# Altium schematic sheet CPU_MIPI_DSI_CSI.SchDoc
size 420 x 297 mm; Scale: 1:1; DocumentType: Схема электрическая принципиальная; SheetNumber: 20; SheetTotal: 32; DocumentTypeShort: Э3; DocumentInvertoryNumber: ㅤ
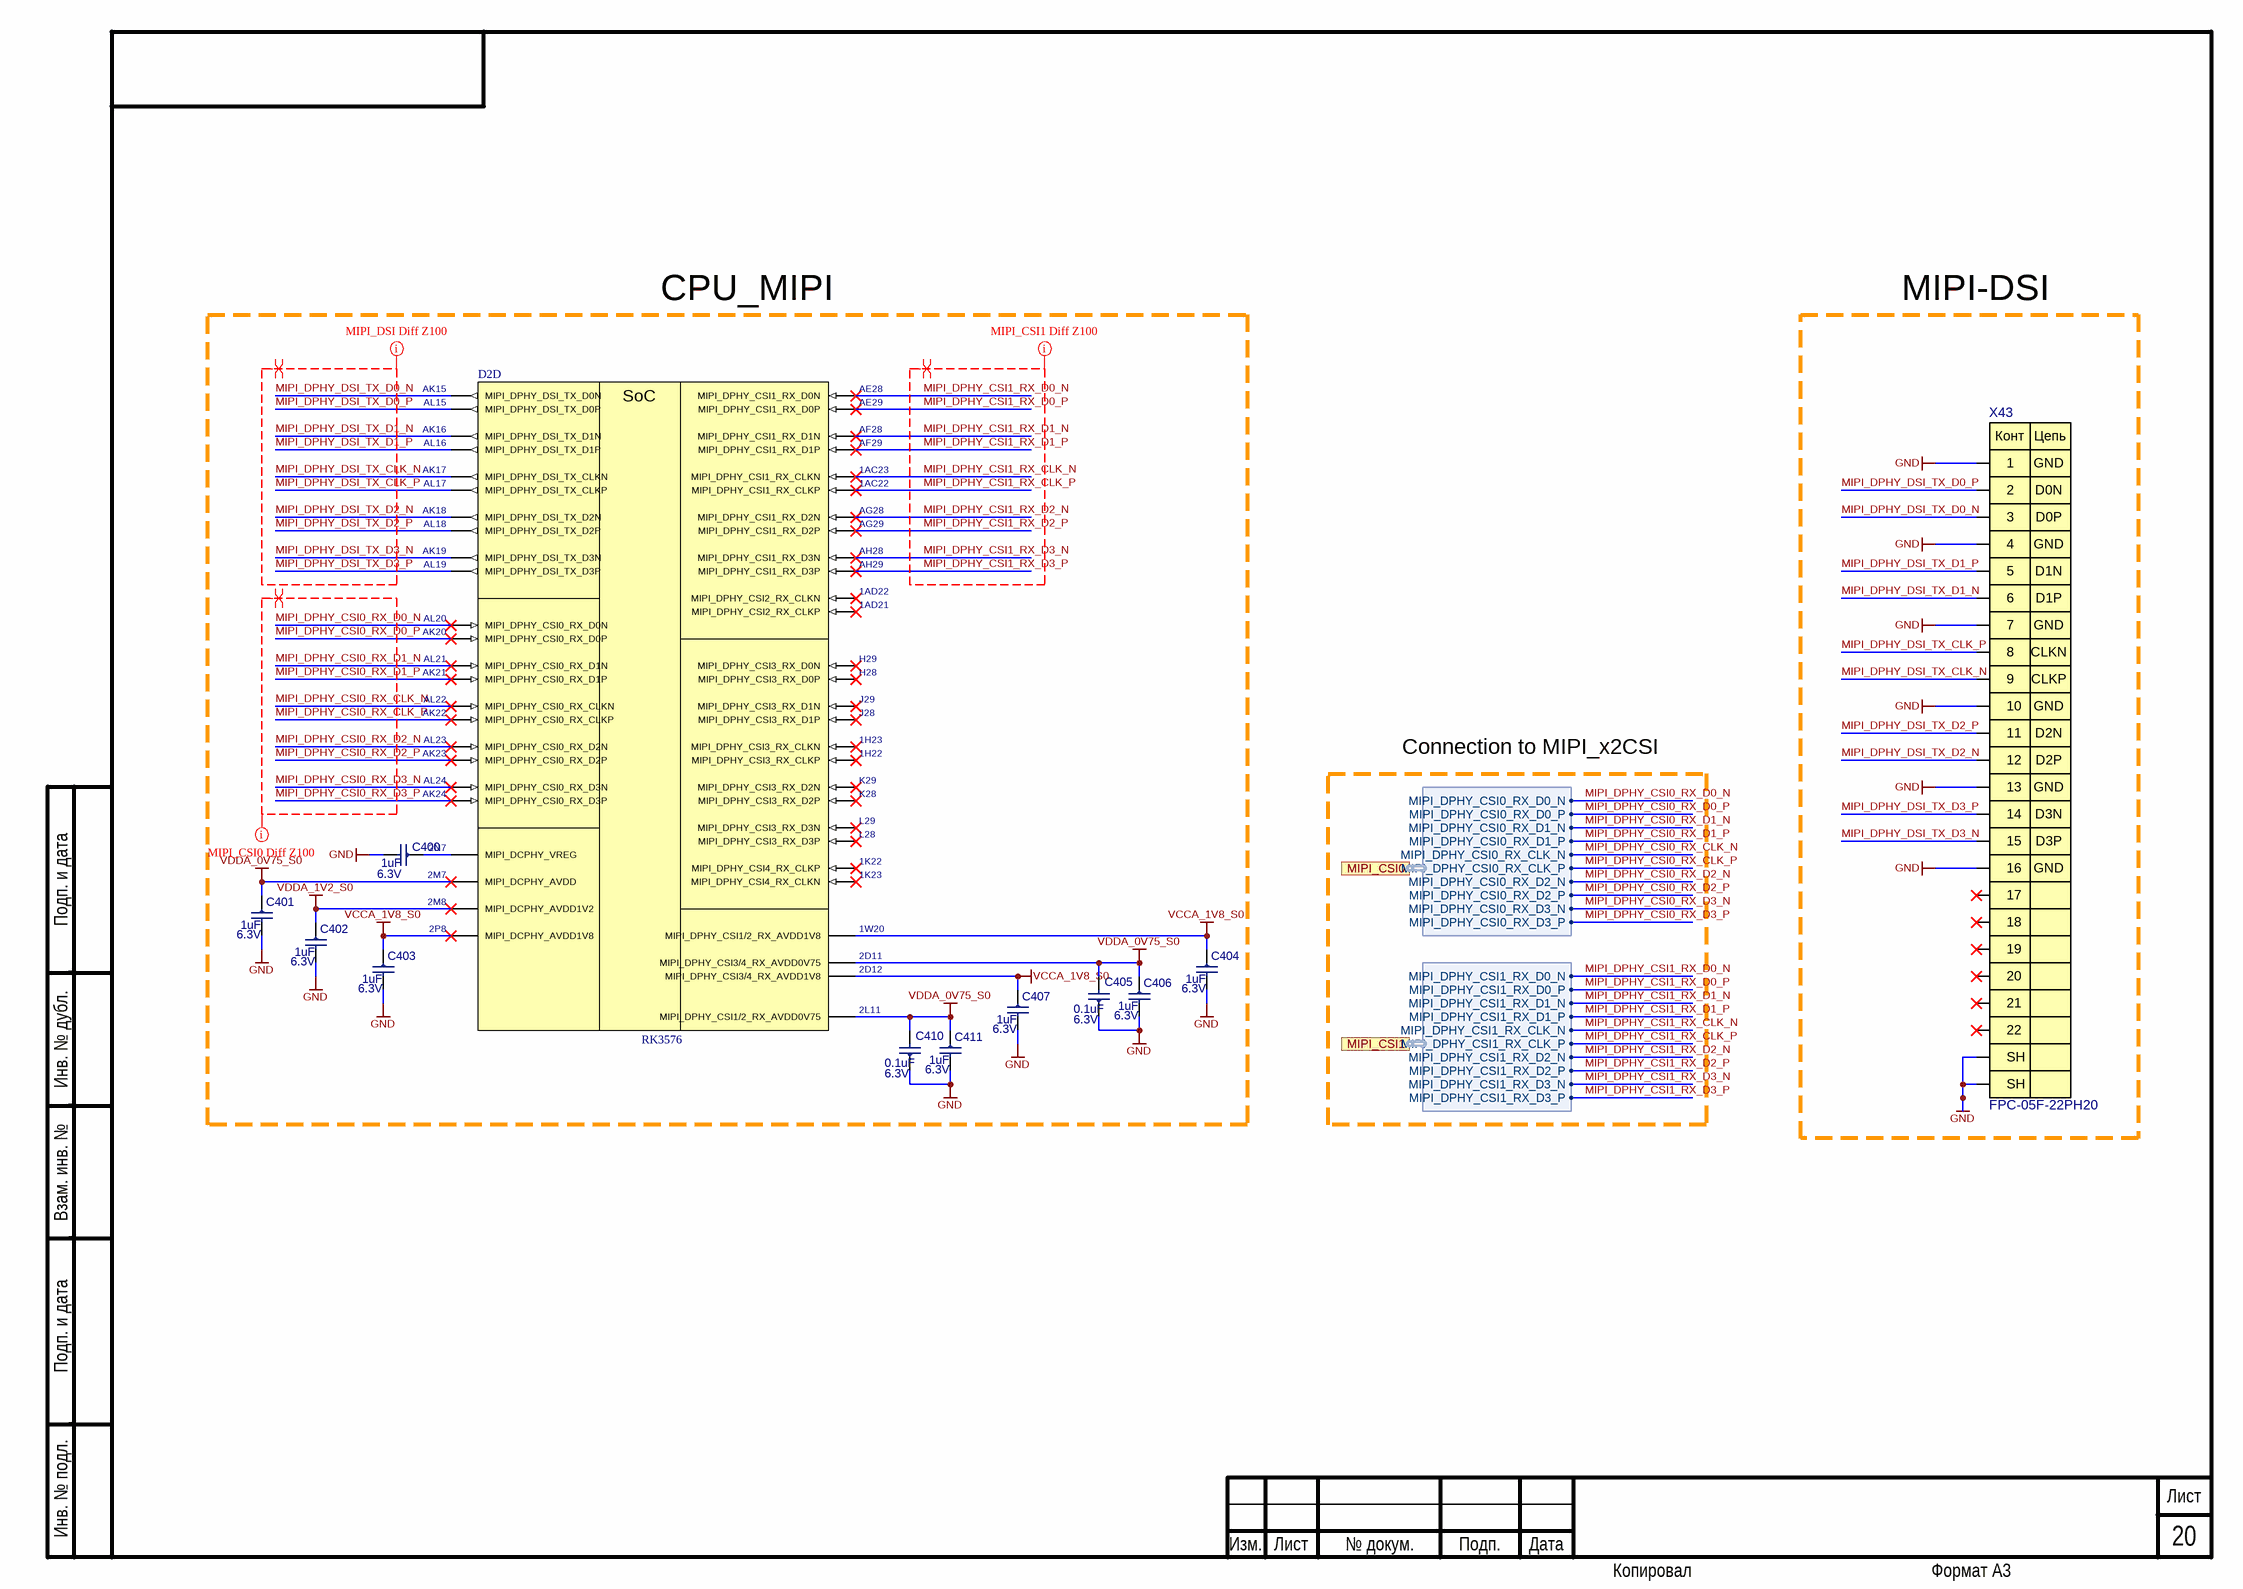
[diagram p0: CPU_MIPI_DSI_CSI.SchDoc]

## Parts
C400  1uF  Voltage: 6.3V  [C0201]
C401  1uF  Voltage: 6.3V  [C0201]
C402  1uF  Voltage: 6.3V  [C0201]
C403  1uF  Voltage: 6.3V  [C0201]
C404  1uF  Voltage: 6.3V  [C0201]
C405  0.1uF  Voltage: 6.3V  [C0201]
C406  1uF  Voltage: 6.3V  [C0201]
C407  1uF  Voltage: 6.3V  [C0201]
C410  0.1uF  Voltage: 6.3V  [C0201]
C411  1uF  Voltage: 6.3V  [C0201]
D2  RK3576  [BGAFCCSP698L]  (part D of 7)
X43  FPC-05F-22PH20  [FPC-05F-22PH20]

## Ports
MIPI_CSI0 (harness MIPI_CSI0), MIPI_CSI1 (harness MIPI_CSI1)

## Harnesses
MIPI_CSI1: MIPI_DPHY_CSI1_RX_D3_P, MIPI_DPHY_CSI1_RX_D3_N, MIPI_DPHY_CSI1_RX_D2_P, MIPI_DPHY_CSI1_RX_D2_N, MIPI_DPHY_CSI1_RX_CLK_P, MIPI_DPHY_CSI1_RX_CLK_N, MIPI_DPHY_CSI1_RX_D1_P, MIPI_DPHY_CSI1_RX_D1_N, MIPI_DPHY_CSI1_RX_D0_P, MIPI_DPHY_CSI1_RX_D0_N
MIPI_CSI0: MIPI_DPHY_CSI0_RX_D3_P, MIPI_DPHY_CSI0_RX_D3_N, MIPI_DPHY_CSI0_RX_D2_P, MIPI_DPHY_CSI0_RX_D2_N, MIPI_DPHY_CSI0_RX_CLK_P, MIPI_DPHY_CSI0_RX_CLK_N, MIPI_DPHY_CSI0_RX_D1_P, MIPI_DPHY_CSI0_RX_D1_N, MIPI_DPHY_CSI0_RX_D0_P, MIPI_DPHY_CSI0_RX_D0_N

## Nets
GND: C400.2 C401.2 C402.2 C403.2 C404.2 C405.1 C406.2 C407.2 C410.1 C411.2 X43.1 X43.4 X43.7 X43.10 X43.13 X43.16 X43.23(SH) X43.24(SH)
VCCA_1V8_S0: C403.1 C404.1 C407.1 D2.1W20(MIPI_DPHY_CSI1/2_RX_AVDD1V8) D2.2D12(MIPI_DPHY_CSI3/4_RX_AVDD1V8) D2.2P8(MIPI_DCPHY_AVDD1V8)
VDDA_0V75_S0: C401.1 C405.2 C406.1 C410.2 C411.1 D2.2D11(MIPI_DPHY_CSI3/4_RX_AVDD0V75) D2.2L11(MIPI_DPHY_CSI1/2_RX_AVDD0V75) D2.2M7(MIPI_DCPHY_AVDD)
VDDA_1V2_S0: C402.1 D2.2M8(MIPI_DCPHY_AVDD1V2)
MIPI_DPHY_CSI0_RX_CLK_N: D2.AL22(MIPI_DPHY_CSI0_RX_CLKN) ; port MIPI_CSI0.MIPI_DPHY_CSI0_RX_CLK_N
MIPI_DPHY_CSI0_RX_CLK_P: D2.AK22(MIPI_DPHY_CSI0_RX_CLKP) ; port MIPI_CSI0.MIPI_DPHY_CSI0_RX_CLK_P
MIPI_DPHY_CSI0_RX_D0_N: D2.AL20(MIPI_DPHY_CSI0_RX_D0N) ; port MIPI_CSI0.MIPI_DPHY_CSI0_RX_D0_N
MIPI_DPHY_CSI0_RX_D0_P: D2.AK20(MIPI_DPHY_CSI0_RX_D0P) ; port MIPI_CSI0.MIPI_DPHY_CSI0_RX_D0_P
MIPI_DPHY_CSI0_RX_D1_N: D2.AL21(MIPI_DPHY_CSI0_RX_D1N) ; port MIPI_CSI0.MIPI_DPHY_CSI0_RX_D1_N
MIPI_DPHY_CSI0_RX_D1_P: D2.AK21(MIPI_DPHY_CSI0_RX_D1P) ; port MIPI_CSI0.MIPI_DPHY_CSI0_RX_D1_P
MIPI_DPHY_CSI0_RX_D2_N: D2.AL23(MIPI_DPHY_CSI0_RX_D2N) ; port MIPI_CSI0.MIPI_DPHY_CSI0_RX_D2_N
MIPI_DPHY_CSI0_RX_D2_P: D2.AK23(MIPI_DPHY_CSI0_RX_D2P) ; port MIPI_CSI0.MIPI_DPHY_CSI0_RX_D2_P
MIPI_DPHY_CSI0_RX_D3_N: D2.AL24(MIPI_DPHY_CSI0_RX_D3N) ; port MIPI_CSI0.MIPI_DPHY_CSI0_RX_D3_N
MIPI_DPHY_CSI0_RX_D3_P: D2.AK24(MIPI_DPHY_CSI0_RX_D3P) ; port MIPI_CSI0.MIPI_DPHY_CSI0_RX_D3_P
MIPI_DPHY_CSI1_RX_CLK_N: D2.1AC23(MIPI_DPHY_CSI1_RX_CLKN) ; port MIPI_CSI1.MIPI_DPHY_CSI1_RX_CLK_N
MIPI_DPHY_CSI1_RX_CLK_P: D2.1AC22(MIPI_DPHY_CSI1_RX_CLKP) ; port MIPI_CSI1.MIPI_DPHY_CSI1_RX_CLK_P
MIPI_DPHY_CSI1_RX_D0_N: D2.AE28(MIPI_DPHY_CSI1_RX_D0N) ; port MIPI_CSI1.MIPI_DPHY_CSI1_RX_D0_N
MIPI_DPHY_CSI1_RX_D0_P: D2.AE29(MIPI_DPHY_CSI1_RX_D0P) ; port MIPI_CSI1.MIPI_DPHY_CSI1_RX_D0_P
MIPI_DPHY_CSI1_RX_D1_N: D2.AF28(MIPI_DPHY_CSI1_RX_D1N) ; port MIPI_CSI1.MIPI_DPHY_CSI1_RX_D1_N
MIPI_DPHY_CSI1_RX_D1_P: D2.AF29(MIPI_DPHY_CSI1_RX_D1P) ; port MIPI_CSI1.MIPI_DPHY_CSI1_RX_D1_P
MIPI_DPHY_CSI1_RX_D2_N: D2.AG28(MIPI_DPHY_CSI1_RX_D2N) ; port MIPI_CSI1.MIPI_DPHY_CSI1_RX_D2_N
MIPI_DPHY_CSI1_RX_D2_P: D2.AG29(MIPI_DPHY_CSI1_RX_D2P) ; port MIPI_CSI1.MIPI_DPHY_CSI1_RX_D2_P
MIPI_DPHY_CSI1_RX_D3_N: D2.AH28(MIPI_DPHY_CSI1_RX_D3N) ; port MIPI_CSI1.MIPI_DPHY_CSI1_RX_D3_N
MIPI_DPHY_CSI1_RX_D3_P: D2.AH29(MIPI_DPHY_CSI1_RX_D3P) ; port MIPI_CSI1.MIPI_DPHY_CSI1_RX_D3_P
MIPI_DPHY_DSI_TX_CLK_N: D2.AK17(MIPI_DPHY_DSI_TX_CLKN) X43.9
MIPI_DPHY_DSI_TX_CLK_P: D2.AL17(MIPI_DPHY_DSI_TX_CLKP) X43.8
MIPI_DPHY_DSI_TX_D0_N: D2.AK15(MIPI_DPHY_DSI_TX_D0N) X43.3
MIPI_DPHY_DSI_TX_D0_P: D2.AL15(MIPI_DPHY_DSI_TX_D0P) X43.2
MIPI_DPHY_DSI_TX_D1_N: D2.AK16(MIPI_DPHY_DSI_TX_D1N) X43.6
MIPI_DPHY_DSI_TX_D1_P: D2.AL16(MIPI_DPHY_DSI_TX_D1P) X43.5
MIPI_DPHY_DSI_TX_D2_N: D2.AK18(MIPI_DPHY_DSI_TX_D2N) X43.12
MIPI_DPHY_DSI_TX_D2_P: D2.AL18(MIPI_DPHY_DSI_TX_D2P) X43.11
MIPI_DPHY_DSI_TX_D3_N: D2.AK19(MIPI_DPHY_DSI_TX_D3N) X43.15
MIPI_DPHY_DSI_TX_D3_P: D2.AL19(MIPI_DPHY_DSI_TX_D3P) X43.14
NetC400_1: C400.1 D2.2N7(MIPI_DCPHY_VREG)

Not connected (* = marked no-connect by the designer): D2 1AD21(MIPI_DPHY_CSI2_RX_CLKP)* 1AD22(MIPI_DPHY_CSI2_RX_CLKN)* 1H22(MIPI_DPHY_CSI3_RX_CLKP)* 1H23(MIPI_DPHY_CSI3_RX_CLKN)* 1K22(MIPI_DPHY_CSI4_RX_CLKP)* 1K23(MIPI_DPHY_CSI4_RX_CLKN)* H28(MIPI_DPHY_CSI3_RX_D0P)* H29(MIPI_DPHY_CSI3_RX_D0N)* J28(MIPI_DPHY_CSI3_RX_D1P)* J29(MIPI_DPHY_CSI3_RX_D1N)* K28(MIPI_DPHY_CSI3_RX_D2P)* K29(MIPI_DPHY_CSI3_RX_D2N)* L28(MIPI_DPHY_CSI3_RX_D3P)* L29(MIPI_DPHY_CSI3_RX_D3N)*; X43 17* 18* 19* 20* 21* 22*

## Layout directives
net class MIPI_CSI1: MIPI_DPHY_CSI1_RX_CLK_N, MIPI_DPHY_CSI1_RX_CLK_P, MIPI_DPHY_CSI1_RX_D0_N, MIPI_DPHY_CSI1_RX_D0_P, MIPI_DPHY_CSI1_RX_D1_N, MIPI_DPHY_CSI1_RX_D1_P, MIPI_DPHY_CSI1_RX_D2_N, MIPI_DPHY_CSI1_RX_D2_P, MIPI_DPHY_CSI1_RX_D3_N, MIPI_DPHY_CSI1_RX_D3_P
net class MIPI_DSI: MIPI_DPHY_DSI_TX_CLK_N, MIPI_DPHY_DSI_TX_CLK_P, MIPI_DPHY_DSI_TX_D0_N, MIPI_DPHY_DSI_TX_D0_P, MIPI_DPHY_DSI_TX_D1_N, MIPI_DPHY_DSI_TX_D1_P, MIPI_DPHY_DSI_TX_D2_N, MIPI_DPHY_DSI_TX_D2_P, MIPI_DPHY_DSI_TX_D3_N, MIPI_DPHY_DSI_TX_D3_P
net class MIPI_CSI0: MIPI_DPHY_CSI0_RX_CLK_N, MIPI_DPHY_CSI0_RX_CLK_P, MIPI_DPHY_CSI0_RX_D0_N, MIPI_DPHY_CSI0_RX_D0_P, MIPI_DPHY_CSI0_RX_D1_N, MIPI_DPHY_CSI0_RX_D1_P, MIPI_DPHY_CSI0_RX_D2_N, MIPI_DPHY_CSI0_RX_D2_P, MIPI_DPHY_CSI0_RX_D3_N, MIPI_DPHY_CSI0_RX_D3_P
differential pair; differential pair class Diff_Z100: MIPI_DPHY_CSI0_RX_CLK_N, MIPI_DPHY_CSI0_RX_CLK_P, MIPI_DPHY_CSI0_RX_D0_N, MIPI_DPHY_CSI0_RX_D0_P, MIPI_DPHY_CSI0_RX_D1_N, MIPI_DPHY_CSI0_RX_D1_P, MIPI_DPHY_CSI0_RX_D2_N, MIPI_DPHY_CSI0_RX_D2_P, MIPI_DPHY_CSI0_RX_D3_N, MIPI_DPHY_CSI0_RX_D3_P, MIPI_DPHY_CSI1_RX_CLK_N, MIPI_DPHY_CSI1_RX_CLK_P, MIPI_DPHY_CSI1_RX_D0_N, MIPI_DPHY_CSI1_RX_D0_P, MIPI_DPHY_CSI1_RX_D1_N, MIPI_DPHY_CSI1_RX_D1_P, MIPI_DPHY_CSI1_RX_D2_N, MIPI_DPHY_CSI1_RX_D2_P, MIPI_DPHY_CSI1_RX_D3_N, MIPI_DPHY_CSI1_RX_D3_P, MIPI_DPHY_DSI_TX_CLK_N, MIPI_DPHY_DSI_TX_CLK_P, MIPI_DPHY_DSI_TX_D0_N, MIPI_DPHY_DSI_TX_D0_P, MIPI_DPHY_DSI_TX_D1_N, MIPI_DPHY_DSI_TX_D1_P, MIPI_DPHY_DSI_TX_D2_N, MIPI_DPHY_DSI_TX_D2_P, MIPI_DPHY_DSI_TX_D3_N, MIPI_DPHY_DSI_TX_D3_P

## Notes on the sheet
- CPU_MIPI
- MIPI-DSI
- (near X43) GND
- (near X43) D0N
- (near X43) D0P
- (near X43) D1N
- (near X43) D1P
- (near X43) CLKN
- (near X43) CLKP
- (near X43) D2N
- Connection to MIPI_x2CSI
- (near X43) D2P
- (near X43) D3N
- (near X43) D3P
- Подп. и дата
- Инв. № дубл.
- Взам. инв. №
- Инв. № подл.
- Изм.
- Лист
- № докум.
- Подп.
- Дата
- Копировал
- Формат А3
- (in symbol FPC-05F-22PH20) Конт; Цепь
- (in symbol RK3576, part D) SoC

## Library data of the parts
C400-C404 C406 C407 C411 = 0201-X5R-6.3V-1uF±20%: Manufacturer: Murata Electronics; NameFromManufacturer: GRM033R60J105MEA2D; Dielectric: X5R; Place: *); Tolerance: 20%; Check: False; Case: C0201; Part Number: 0201-X5R-6.3V-1uF±20%; Value: 1uF; Temperature: -55°C~85°C; ComponentLink2Description: Link to datasheet; ComponentLink1Description: DATASHEET; ComponentLink2URL: https://www.terraelectronica.ru/product/1209278; ComponentLink1URL: Datasheets/capacitors/GRM033R60J105MEA2-61A.pdf; Last changed: 27.10.2022
C405 C410 = 0201-X5R-6.3V-0.1uF±10%: Manufacturer: Yageo; NameFromManufacturer: CC0201KRX5R5BB104; Dielectric: X5R; Place: *); Tolerance: 10%; Check: False; Case: C0201; Part Number: 0201-X5R-6.3V-0.1uF±10%; Value: 0.1uF; Temperature: -55°C~85°C; ComponentLink2Description: Link to datasheet; ComponentLink1Description: DATASHEET; ComponentLink2URL: https://www.terraelectronica.ru/product/1020032; ComponentLink1URL: Datasheets/capacitors/UPY-GPHC_X5R_4V-to-50V_27.pdf; Last changed: 27.10.2022
D2 = RK3576: SoC 4xCortex-A72@2.2Ghz+4xCortex-A53@2Ghz, LPDDR4/4X/5/5X, SDIO/eMMC/UFS/FSPI, BGA 16.1x17.2x1.0mm; Manufacturer: Rockship; Place: *); Check: False; Part Number: RK3576; Temperature: -40°C~85°C; Value: RK3576; ComponentLink1Description: DATASHEET; NameFromManufacturer: RK3576; ComponentLink1URL: https://wiki.friendlyelec.com/wiki/images/b/bf/Rockchip_RK3576_Datasheet_V1.5-20241216.pdf; Last changed: 06.01.2026
X43 = FPC-05F-22PH20: FFC/FPC Connector 22 Position 0.5mm Pitch Bottom Contact Surface Mount, Right Angle -25℃~+85℃; Manufacturer: XUNPU; Check: False; Part Number: FPC-05F-22PH20; Value: FPC-05F-22PH20; NameFromManufacturer: FPC-05F-22PH20